# Altium schematic sheet GPS.SchDoc
size A
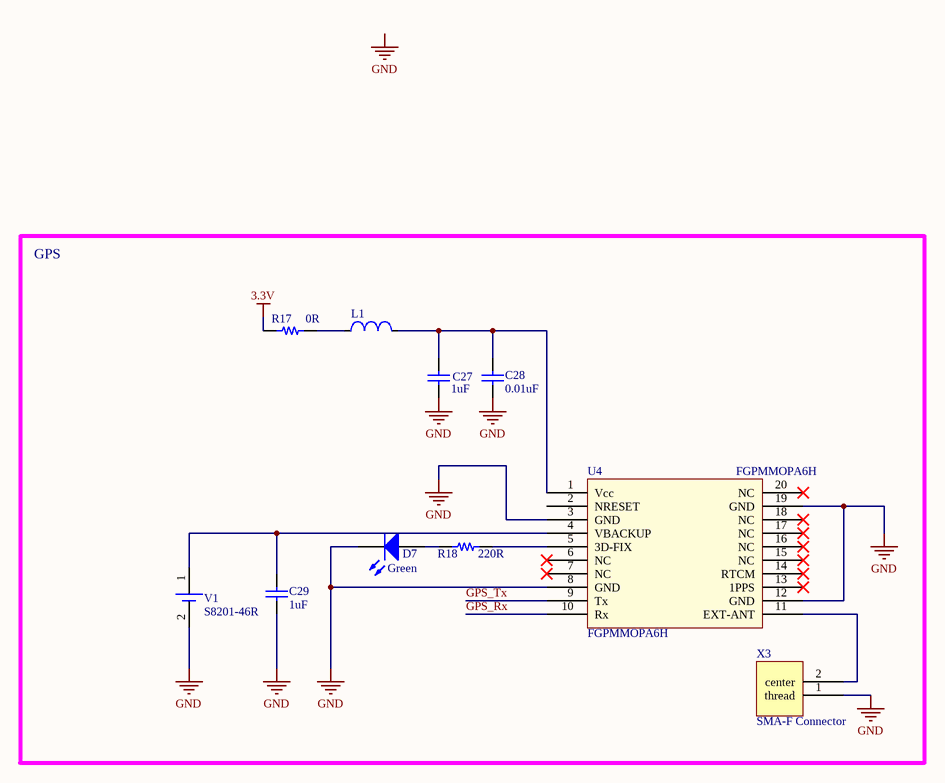
[diagram p0: GPS.SchDoc]

## Parts
C27  value 1uF  [C0603]  (hidden comment: CAP CER 0603 1uF 25V X7R 20%)
C28  value 0.01uF  [C0603]  (hidden comment: CAP CER 0603 0.01uF 50V X7R 10%)
C29  value 1uF  [C0603]  (hidden comment: CAP CER 0603 1uF 16V X7R 10%)
D7  Green  [LED1206]
L1  Ferrite bead 60R@100MHz  [I0805]  (value not drawn)
R17  value 0R  [R0603]  (hidden comment: RES 0603 0R)
R18  value 220R  [R0603]  (hidden comment: RES 0603 220R 5% 1/4W)
U4  FGPMMOPA6H  [FGPMMOPA6H]
V1  S8201-46R  [S8201-46R]
X3  SMA-F Connector  [SMA-F]

## Blocks framed on the sheet
GPS: C27-C29 D7 L1 R17 R18 U4 V1 X3

## Nets
3.3V: R17.1
GND: C27.1 C28.1 C29.1 D7.2(K) U4.3(GND) U4.8(GND) U4.12(GND) U4.19(GND) V1.2 X3.1(thread)
GPS_Rx: U4.10(Rx)
GPS_Tx: U4.9(Tx)
NetC27_2: C27.2 C28.2 L1.2 U4.1(Vcc)
NetC29_2: C29.2 U4.4(VBACKUP) V1.1
NetD7_1: D7.1(A) R18.1
NetL1_1: L1.1 R17.2
NetR18_2: R18.2 U4.5(3D-FIX)
NetU4_11: U4.11(EXT-ANT) X3.2(center)

Not connected (* = marked no-connect by the designer): U4 2(NRESET) 6(NC)* 7(NC)* 13(1PPS)* 14(RTCM)* 15(NC)* 16(NC)* 17(NC)* 18(NC)* 20(NC)*

## Notes on the sheet
- Labels drawn without touching a wire or pin: GND

## Library data of the parts
C27 = CAP CER 0603 1uF 25V X7R 20%: 1uF ceramic capacitor; Manufacturer: TDK Corporation; Manufacturer Part Number: CGA3E1X7R1E105M080AC; Supplier_Link: http://www.digikey.ca/product-detail/en/CGA3E1X7R1E105M080AC/445-12548-1-ND/3954214; Tolerance: 20%; Voltage rating: 25V; Price: 0.24; Supplier 1: Digi-Key; Supplier Part Number 1: 445-12548-1-ND; Part_Number: CGA3E1X7R1E105M080AC
C28 = CAP CER 0603 0.01uF 50V X7R 10%: 0.01uF ceramic capacitor; Manufacturer: TDK Corporation; Manufacturer Part Number: CGA3E2X7R1H103K080AA; Supplier_Link: http://www.digikey.ca/product-detail/en/CGA3E2X7R1H103K080AA/445-5662-1-ND/2443702; Tolerance: 10%; Voltage rating: 50V; Price: 0.14; Supplier 1: Digi-Key; Supplier Part Number 1: 445-5662-1-ND; Part_Number: CGA3E2X7R1H103K080AA
C29 = CAP CER 0603 1uF 16V X7R 10%: 1uF ceramic capacitor; Manufacturer: Samsung Electro-Mechanics; Part_Number: CL10B105KO8VPNC; Supplier_Link: https://www.digikey.ca/product-detail/en/samsung-electro-mechanics/CL10B105KO8VPNC/1276-6613-1-ND/5961472; Tolerance: 10%; Voltage rating: 16V; Price: 0.32; Supplier 1: Digi-Key; Supplier Part Number 1: 1276-6613-1-ND
D7 = LTST-C150KGKT: Green LED 1206; Manufacturer: Liteon; Forward Voltage: 2V @ 20 mA; Price: 0.55; Price_10: 0.40; Part_Number: LTST-C150KGKT; Supplier_Link: http://www.digikey.ca/product-detail/en/LTST-C150KGKT/160-1404-1-ND/386759
L1 = BKP2125HS600-T: 0805 Ferrite bead, 60 Ohms at 100 MHz; Manufacturer: Taiyo Yuden; Value: 60 Ohms @ 100 MHz; Current_Rating: 3A; Part_Number: BKP2125HS600-T; Supplier_Link: http://www.digikey.ca/product-detail/en/BKP2125HS600-T/587-1932-1-ND/1465402
R17 = RES 0603 0R: 0 Ohm Resistor; Part_Number: CRCW06030000Z0EA; Manufacturer: Vishay Dale; Power: 0.1W; Price: 0.11; Supplier_Link: http://www.digikey.ca/product-detail/en/CRCW06030000Z0EA/541-0.0GCT-ND/1179296; Supplier 1: Digi-Key; Supplier Part Number 1: 541-0.0GCT-ND; Manufacturer Part Number: CRCW06030000Z0EA
R18 = RES 0603 220R 5% 1/4W: 220 Ohms resistor, 1/4W; Manufacturer: Rohm Semiconductor; Part_Number: ESR03EZPJ221; Supplier_Link: ESR03EZPJ221; Price: 0.15; Supplier_Link: http://www.digikey.ca/product-detail/en/ESR03EZPJ221/RHM220DCT-ND/1983788
U4 = FGPMMOPA6H: GPS Standalone Module; Manufacturer: GlobalTop Technology Inc.; Type: GPS Module; Part_Number: FGPMMOPA6H; Supplier_Link: http://www.adafruit.com/products/790
V1 = S8201-46R: Manufacturer: Harwin Inc.; Part_Number: S8201-46R; Supplier_Link: https://www.digikey.ca/product-detail/en/harwin-inc/S8201-46R/952-1662-1-ND/2627209; Price: 0.68
X3 = 5-1814832-1: SMA Connector Jack, Female Socket 50 Ohm Through Hole Solder; Manufacturer: TE Connectivity AMP Connectors; Supplier_Link: http://www.digikey.ca/product-detail/en/te-connectivity-amp-connectors/5-1814832-1/A97594-ND/1755982; Part_Number: 5-1814832-1; Price: 2.8